# EAGLE schematic Led4I2C (EAGLE 6.4)
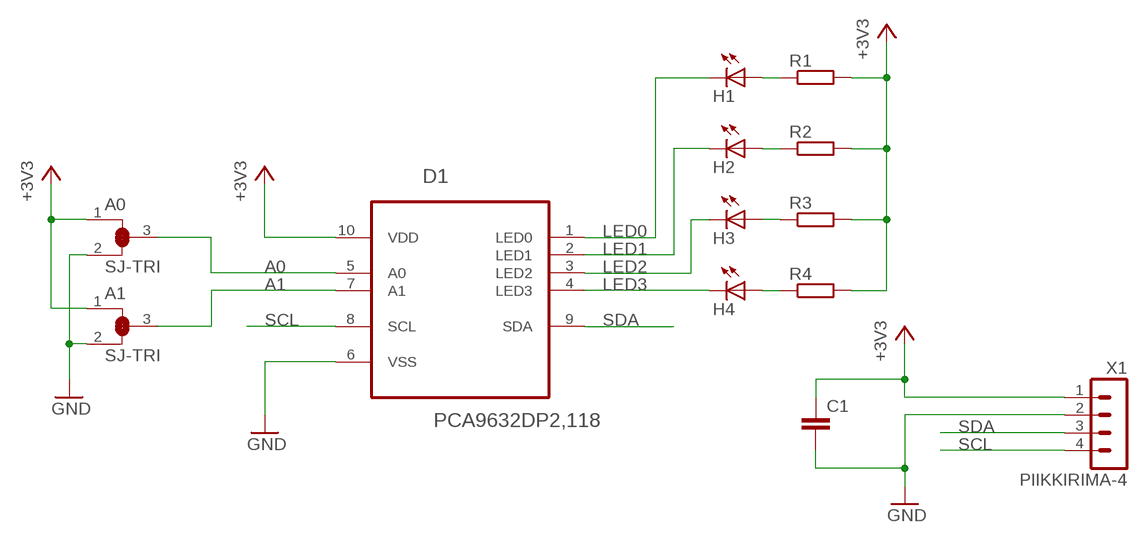
[diagram p0: schematic, sheet 1]

## Parts
A0  SJ-TRI  [SJ-SMALL-TRI]
A1  SJ-TRI  [SJ-SMALL-TRI]
C1  C-EUC0603  [C0603]
D1  PCA9632DP2,118  [SOP50P490X110-10N]
H1  LEDCHIP-LED0603  [CHIP-LED0603]
H2  LEDCHIP-LED0603  [CHIP-LED0603]
H3  LEDCHIP-LED0603  [CHIP-LED0603]
H4  LEDCHIP-LED0603  [CHIP-LED0603]
R1  R-EU_R0603  [R0603]
R2  R-EU_R0603  [R0603]
R3  R-EU_R0603  [R0603]
R4  R-EU_R0603  [R0603]
X1  PIIKKIRIMA-4  [PIIKKIRIMA-4]

## Nets
+3V3: A0.1 A1.1 C1.1 D1.10(VDD) R1.2 R2.2 R3.2 R4.2 X1.1
A0: A0.3 D1.5(A0)
A1: A1.3 D1.7(A1)
GND: A0.2 A1.2 C1.2 D1.6(VSS) X1.2
LED0: D1.1(LED0) H1.C
LED1: D1.2(LED1) H2.C
LED2: D1.3(LED2) H3.C
LED3: D1.4(LED3) H4.C
N$7: H1.A R1.1
N$8: H2.A R2.1
N$9: H3.A R3.1
N$10: H4.A R4.1
SCL: D1.8(SCL) X1.4
SDA: D1.9(SDA) X1.3

## Library data of the parts
A0 A1 = OMAT_IC:SJ-TRI
C1 = rcl:C-EU: CAPACITOR, European symbol
D1 = NXP_By_element14_Batch_1:PCA9632DP2,118: 4-bit Fm+ I2C-bus low power LED driver; MPN: PCA9632DP2,118; OC_FARNELL: 1867849; OC_NEWARK: 70R6723; PACKAGE: TSSOP-10; SUPPLIER: NXP
H1-H4 = OMAT_IC:LED: LED OSRAM: - CHIPLED LG R971, LG N971, LY N971, LG Q971, LY Q971, LO R971, LY R971 LH N974, LH R974 LS Q976, LO Q976, LY Q976 LO Q996 - Hyper CHIPLED LW Q18S LB Q993, LB Q99A, LB R99A - SideLED LS A670, LO A670, LY A670, LG A670, LP A670 LB A673, LV A673, LT A673, LW A673 LH A674 LY A675 LS A676, LA A676, LO A676, LY A676, LW A676 LS A679, LY A679, LG A679 - Hyper Micro SIDELED® LS Y876, LA Y876, LO Y876, LY Y876 LT Y87S - SmartLED LW L88C, LW L88S LB L89C, LB L89S, LG L890 LS L89K, LO L89K, LY L89K LS L896, LA L896, LO L896, LY L896 - TOPLED LS T670, LO T670, LY T670, LG T670, LP T670 LSG T670, LSP T670, LSY T670, LOP T670, LYG T670 LG T671, LOG T671, LSG T671 LB T673, LV T673, LT T673, LW T673 LH T674 LS T676, LA T676, LO T676, LY T676, LB T676, LH T676, LSB T676, LW T676 LB T67C, LV T67C, LT T67C, LS T67K, LO T67K, LY T67K, LW E67C LS E67B, LA E67B, LO E67B, LY E67B, LB E67C, LV E67C, LT E67C LW T67C LS T679, LY T679, LG T679 LS T770, LO T770, LY T770, LG T770, LP T770 LB T773, LV T773, LT T773, LW T773 LH T774 LS E675, LA E675, LY E675, LS T675 LS T776, LA T776, LO T776, LY T776, LB T776 LHGB T686 LT T68C, LB T68C - Hyper Mini TOPLED® LB M676 - Mini TOPLED Santana® LG M470 LS M47K, LO M47K, LY M47K Source: http://www.osram.convergy.de LUXEON: - LUMILED® LXK2-PW12-R00, LXK2-PW12-S00, LXK2-PW14-U00, LXK2-PW14-V00 LXK2-PM12-R00, LXK2-PM12-S00, LXK2-PM14-U00 LXK2-PE12-Q00, LXK2-PE12-R00, LXK2-PE12-S00, LXK2-PE14-T00, LXK2-PE14-U00 LXK2-PB12-K00, LXK2-PB12-L00, LXK2-PB12-M00, LXK2-PB14-N00, LXK2-PB14-P00, LXK2-PB14-Q00 LXK2-PR12-L00, LXK2-PR12-M00, LXK2-PR14-Q00, LXK2-PR14-R00 LXK2-PD12-Q00, LXK2-PD12-R00, LXK2-PD12-S00 LXK2-PH12-R00, LXK2-PH12-S00 LXK2-PL12-P00, LXK2-PL12-Q00, LXK2-PL12-R00 Source: www.luxeon.com KINGBRIGHT: KA-3528ASYC Source: www.kingbright.com
R1-R4 = rcl:R-EU_: RESISTOR, European symbol
X1 = OMAT_IC:PIIKKIRIMA-4